# EasyEDA schematic Riego 2.0 b.json
TITLE: Sheet_1; REV: 1.0; Date: 2021-02-21; Sheet: 1/1; Drawn By: Migue27au; Company: Your Company
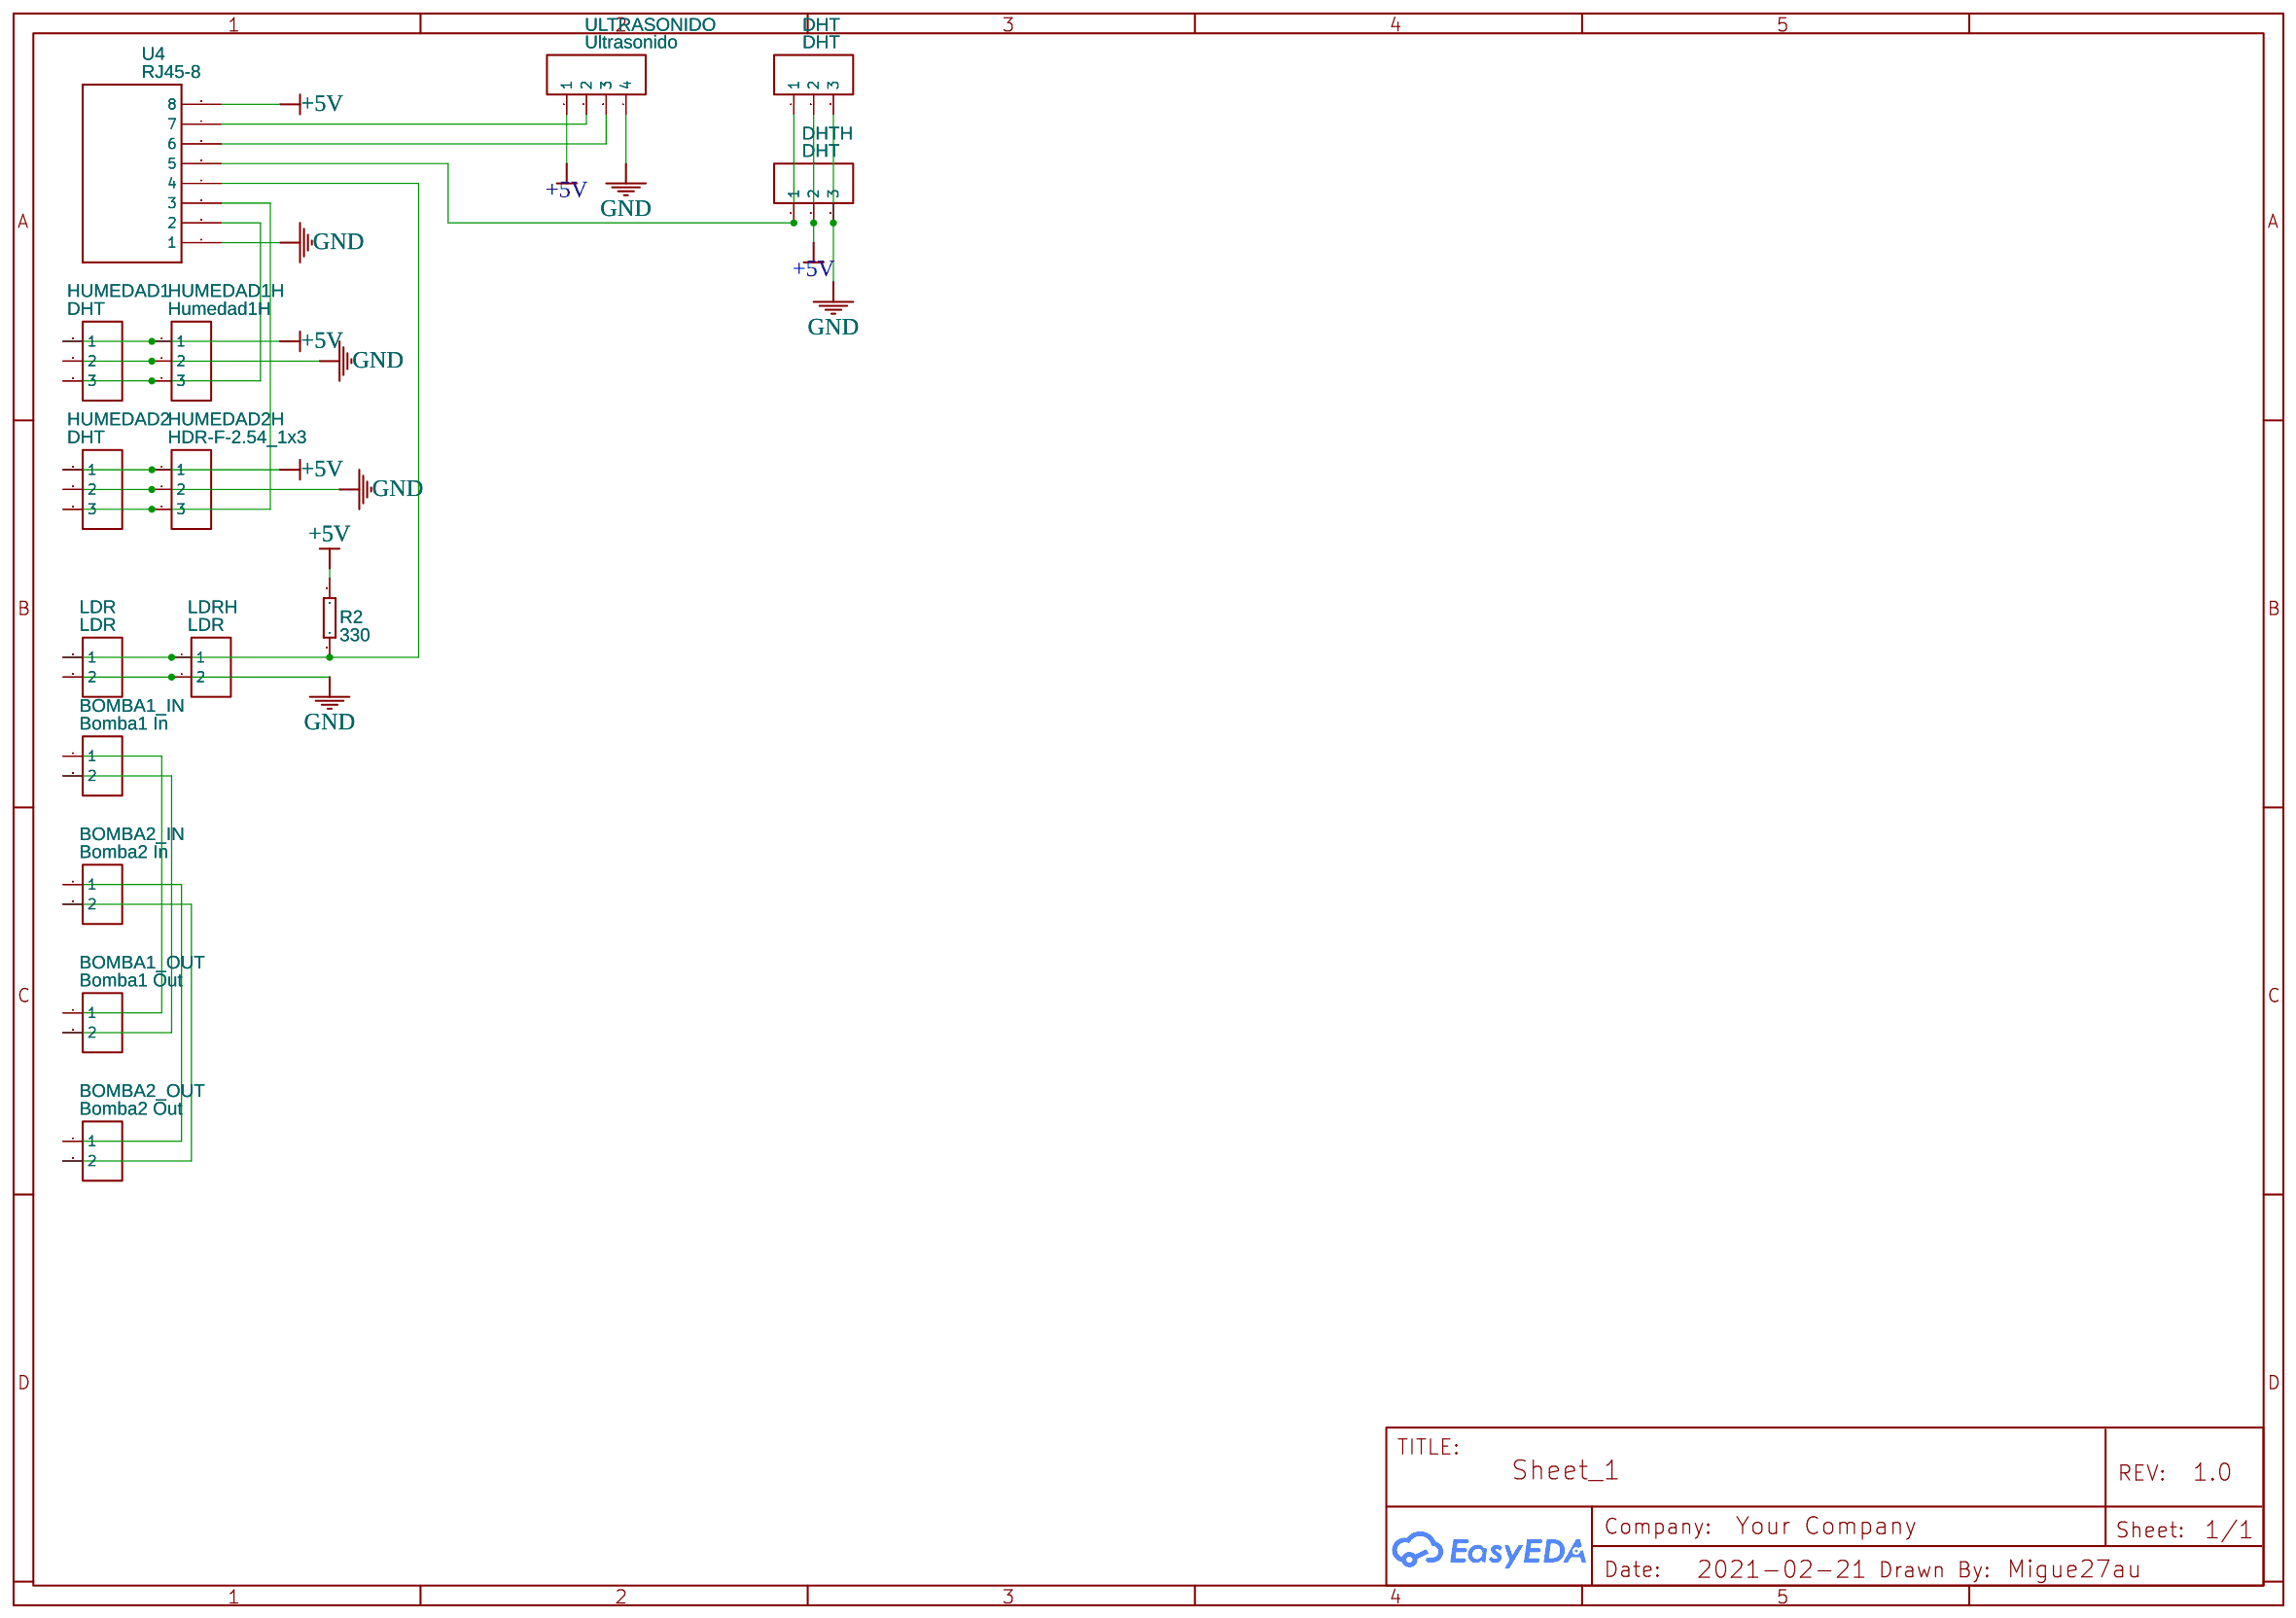
[diagram p0: schematic sheet]

## Parts
BOMBA1_IN  Bomba1 In  [CONN-TH_2P-P5.08]
BOMBA1_OUT  Bomba1 Out  [CONN-TH_2P-P5.08]
BOMBA2_IN  Bomba2 In  [CONN-TH_2P-P5.08]
BOMBA2_OUT  Bomba2 Out  [CONN-TH_2P-P5.08]
DHT  DHT  [CONN-TH_3P-P5.08]
DHTH  DHT  [HDR-F-2.54_1X3]
HUMEDAD1  DHT  [CONN-TH_3P-P5.08]
HUMEDAD1H  Humedad1H  [HDR-F-2.54_1X3]
HUMEDAD2  DHT  [CONN-TH_3P-P5.08]
HUMEDAD2H  HDR-F-2.54_1x3  [HDR-F-2.54_1X3]
LDR  LDR  [CONN-TH_2P-P5.08]
LDRH  LDR  [HDR-F-2.54_1X2]
R2  330  [RTH025W]
U4  RJ45-8  [RJ45-8]
ULTRASONIDO  Ultrasonido  [HDR-F-2.54_1X4]

## Library data of the parts
BOMBA1_IN BOMBA1_OUT BOMBA2_IN BOMBA2_OUT LDR = CONN-TH_2P-P5.08: Supplier: LCSC; Contributor: LCEDA_Lib
DHT HUMEDAD1 HUMEDAD2 = CONN-TH_3P-P5.00: Supplier: LCSC; Contributor: LCEDA_Lib
DHTH HUMEDAD1H HUMEDAD2H = HDR-F-2.54_1x3: Supplier Part: C146690; Supplier: LCSC; Contributor: LCEDA_Lib
LDRH = HDR-F-2.54_1x2: Supplier Part: C49661; Supplier: LCSC; Contributor: LCEDA_Lib
R2 = RESISTOR: Contributor: DangerousPrototype
U4 = RJ45-8: Contributor: SparkFun
ULTRASONIDO = HDR-F-2.54_1x4: Supplier Part: C225501; Supplier: LCSC; Contributor: LCEDA_Lib

## Nets
+5V: DHT.2 DHTH.2 HUMEDAD1.1 HUMEDAD1H.1 HUMEDAD2.1 HUMEDAD2H.1 R2.2 U4.8 ULTRASONIDO.1
GND: DHT.3 DHTH.3 HUMEDAD1.2 HUMEDAD1H.2 HUMEDAD2.2 HUMEDAD2H.2 LDR.2 LDRH.2 U4.1 ULTRASONIDO.4
Net-(BOMBA1_IN-1): BOMBA1_IN.1 BOMBA1_OUT.1
Net-(BOMBA1_IN-2): BOMBA1_IN.2 BOMBA1_OUT.2
Net-(BOMBA2_IN-1): BOMBA2_IN.1 BOMBA2_OUT.1
Net-(BOMBA2_IN-2): BOMBA2_IN.2 BOMBA2_OUT.2
Net-(DHT-1): DHT.1 DHTH.1 U4.5
Net-(HUMEDAD1-3): HUMEDAD1.3 HUMEDAD1H.3 U4.2
Net-(HUMEDAD2-3): HUMEDAD2.3 HUMEDAD2H.3 U4.3
Net-(LDR-1): LDR.1 LDRH.1 R2.1 U4.4
Net-(U4-6): U4.6 ULTRASONIDO.3
Net-(U4-7): U4.7 ULTRASONIDO.2
